# Altium project Smartplug.PrjPCB
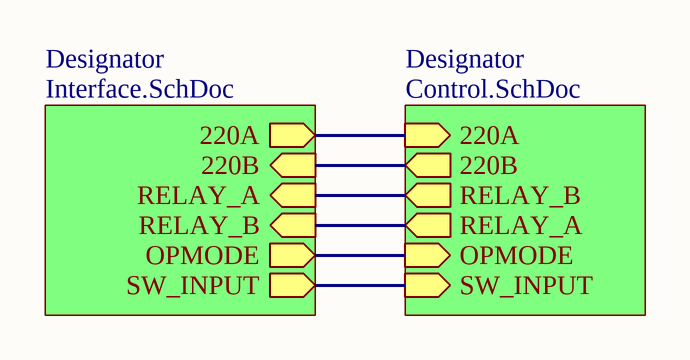
[diagram p0: Smartplug.SchDoc]
3 sheets, 28 parts. Net scope: hierarchical (ports join the sheet entries above them; power ports are global).
Board file: Smartplug.PcbDoc
Sheets:
  Smartplug.SchDoc
    Designator = Control.SchDoc
    Designator = Interface.SchDoc

## Sheet Smartplug.SchDoc
size A

### Sub-sheets
Designator = Control.SchDoc: SW_INPUT (in), 220A (in), 220B (out), OPMODE (in), RELAY_A (out), RELAY_B (out)
Designator = Interface.SchDoc: SW_INPUT (out), 220B (in), 220A (out), RELAY_A (in), RELAY_B (in), OPMODE (out)

### Nets
K1_IN: sheet Designator/220B, sheet Designator/220B
SWIN: sheet Designator/SW_INPUT, sheet Designator/SW_INPUT
NetJ2_1: sheet Designator/220A, sheet Designator/220A
NetJ4_1: sheet Designator/OPMODE, sheet Designator/OPMODE
NetK1_5: sheet Designator/RELAY_B, sheet Designator/RELAY_A
NetK2_5: sheet Designator/RELAY_A, sheet Designator/RELAY_B

## Sheet Control.SchDoc
size A
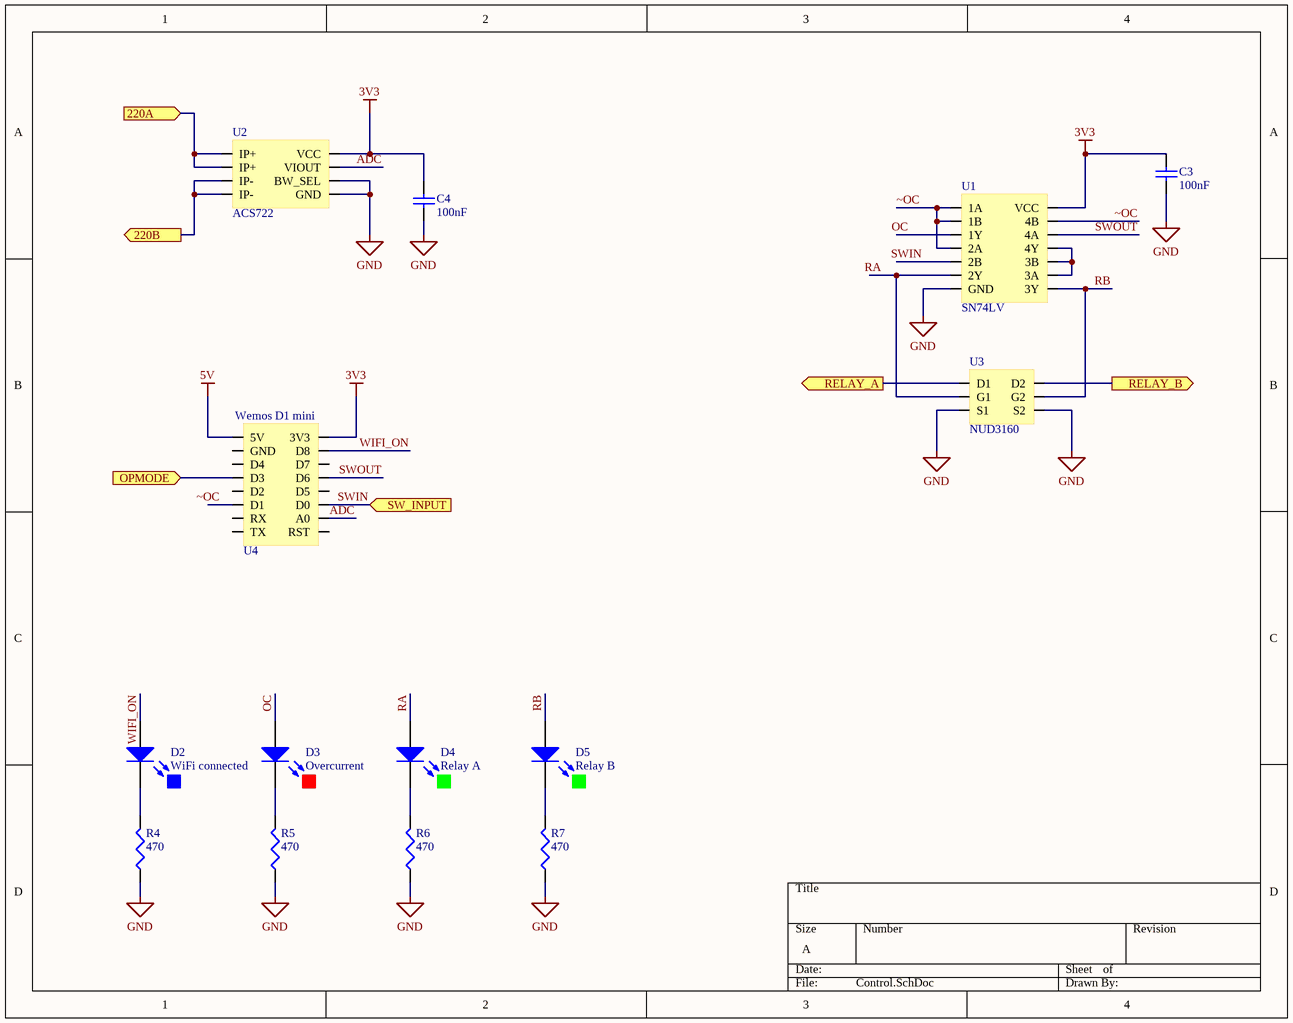
[diagram p1: Control.SchDoc]

### Parts
C3  value 100nF  [C0805]  (hidden comment: Cap)
C4  value 100nF  [C0805]  (hidden comment: Cap)
D2  WiFi connected  [3.2X1.6X1.1]
D3  Overcurrent  [3.2X1.6X1.1]
D4  Relay A  [3.2X1.6X1.1]
D5  Relay B  [3.2X1.6X1.1]
R4  value 470  [J1-0603]  (hidden comment: Res3)
R5  value 470  [J1-0603]  (hidden comment: Res3)
R6  value 470  [J1-0603]  (hidden comment: Res3)
R7  value 470  [J1-0603]  (hidden comment: Res3)
U1  SN74LV  [TSSOP14]
U2  ACS722  [SOIC8]
U3  NUD3160  [SC-74]
U4  Wemos D1 mini  [WEMOS_D1]

### Ports
220A (in), 220B (out), OPMODE (in), RELAY_A (out), RELAY_B (out), SW_INPUT (in)

### Nets
3V3: C3.2 C4.2 U1.14(VCC) U2.8(VCC) U4.16(3V3)
5V: U4.1(5V)
GND: C3.1 C4.1 R4.1 R5.1 R6.1 R7.1 U1.7(GND) U2.5(GND) U2.6(BW_SEL) U3.1(S1) U3.4(S2)
ADC: U2.7(VIOUT) U4.10(A0)
K1_IN: U2.3(IP-) U2.4(IP-) ; port 220B
OC: D3.1(A) U1.3(1Y)
RA: D4.1(A) U1.6(2Y) U3.2(G1)
RB: D5.1(A) U1.8(3Y) U3.5(G2)
SWIN: U1.5(2B) U4.11(D0) ; port SW_INPUT
SWOUT: U1.12(4A) U4.13(D6)
WIFI_ON: D2.1(A) U4.15(D8)
~OC: U1.1(1A) U1.2(1B) U1.4(2A) U1.13(4B) U4.6(D1)
NetD2_2: D2.2(K) R4.2
NetD3_2: D3.2(K) R5.2
NetD4_2: D4.2(K) R6.2
NetD5_2: D5.2(K) R7.2
NetJ2_1: U2.1(IP+) U2.2(IP+) ; port 220A
NetJ4_1: U4.4(D3) ; port OPMODE
NetK1_5: U3.3(D2) ; port RELAY_B
NetK2_5: U3.6(D1) ; port RELAY_A
NetU1_9: U1.9(3A) U1.10(3B) U1.11(4Y)

Not connected (* = marked no-connect by the designer): U4 2(GND) 3(D4) 5(D2) 7(RX) 8(TX) 9(RST) 12(D5) 14(D7)

### Library data of the parts
C3 C4 = Cap: Capacitor; Manufacturer 1: KEMET; Manufacturer Part Number 1: C0805C104Z5VACTU; Description 1: KEMET         C0805C104Z5VACTU.             CERAMIC CAPACITOR, 0.1UF, 50V, Y5V, +80,-20%, 0805; Dielectric Material: Ceramic; Voltage Rating: 50V; Tolerance: 80%; Dielectric: Y5V; Dissipation Factor: 5%; Published: 8-Jun-2000; LatestRevisionDate: 17-Jul-2002; LatestRevisionNote: Re-released for DXP Platform.; PackageReference: RAD-0.3; Publisher: Altium Limited; PackageDescription: Radial Cap, Thru-Hole; 2 Leads; 0.3 in Pin Spacing; Supplier 1: Digi-Key; Supplier Part Number 1: 399-1177-6-ND; Stock: 978536; Pricing 1: 1=0.1, 10=0.057, 100=0.0254, 500=0.01818, 1000=0.01428 (USD); Mount: Surface Mount,PCB; Case/Package: 0805; Number of Pins: 2; Case Code (Metric): 2012; Case Code (Imperial): 0805; Min Operating Temperature: -30°C; Max Operating Temperature: 85°C; Package Quantity: 1; Capacitance: 100nF; Packaging: Tape and Reel; Voltage Rating (DC): 50V; Termination: SMD/SMT; Voltage: 50V; Length: 2mm; Height: 0.9mm; Lead Pitch: 0.75mm; Width: 0.049inch; Thickness: 0.039inch; Depth: 1.25mm; Radiation Hardening: No; REACH SVHC: No SVHC; Lead Free: Lead Free; ComponentLink1URL: http://www.alliedelec.com/m/d/9bfe7773041ffe9d406e68bc7b377fdd.pdf?src-supplier=Allied+Electronics; ComponentLink1Description: http://www.alliedelec.com/m/d/9bfe7773041ffe9d406e68bc7b377fdd.pdf?src-supplier=Allied+Electronics; ComponentLink2URL: https://www.verical.com/server-webapp/html/getDatasheet?partID=37101&src-supplier=Verical; ComponentLink2Description: https://www.verical.com/server-webapp/html/getDatasheet?partID=37101&src-supplier=Verical; ComponentLink3URL: https://www.verical.com/server-webapp/html/getDatasheet?partID=321176&src-supplier=Verical; ComponentLink3Description: https://www.verical.com/server-webapp/html/getDatasheet?partID=321176&src-supplier=Verical; ComponentLink4URL: http://www.farnell.com/datasheets/2123124.pdf?src-supplier=Element14; ComponentLink4Description: http://www.farnell.com/datasheets/2123124.pdf?src-supplier=Element14
D2-D5 = LED2: Typical RED, GREEN, YELLOW, AMBER GaAs LED; Manufacturer 1: Stanley; Manufacturer Part Number 1: BR1101W-TR; Description 1: Red 1206 152/141° 12.8 mcd Clear 1.7 V LED Surface Mount; Lens Style: Clear; Forward Voltage: 1.7V; Viewing Angle: 141°; Wavelength: 660nm; Luminous Intensity: 12.8mcd; Published: 8-Jun-2000; LatestRevisionDate: 17-Jul-2002; LatestRevisionNote: Re-released for DXP Platform.; PackageVersion: Feb-2002; PackageReference: 3.2X1.6X1.1; Publisher: Altium Limited; PackageDescription: SM LED; 2 Flat Leads; Supplier 1: Digi-Key; Supplier Part Number 1: 404-1042-6-ND; Stock: 56287; Pricing 1: 1=0.47, 10=0.334, 100=0.195, 500=0.13368, 1000=0.1114 (USD); Mount: Surface Mount; Case/Package: 1206; Color: Red; Packaging: Cut Tape; Length: 3mm; Height: 1.5mm; Width: 1.5mm; Lead Free: Lead Free; ComponentLink1URL: http://www1.futureelectronics.com/doc/STANLEY/BR1101W-TR.pdf?src-supplier=Future+Electronics; ComponentLink1Description: http://www1.futureelectronics.com/doc/STANLEY/BR1101W-TR.pdf?src-supplier=Future+Electronics
R4-R7 = Res3: Resistor; Manufacturer 1: TE Connectivity; Manufacturer Part Number 1: CRGCQ0603J470R; Description 1: TE CONNECTIVITY - CRGCQ0603J470R - RES, 470R, 5%, 0603, THICK FILM; Resistance: 470R; Tolerance: 5%; Max Power Dissipation: 100mW; Temperature Coefficient: 100ppm/°C; Published: 8-Jun-2000; LatestRevisionDate: 29-May-2009; LatestRevisionNote: IPC-7351 Footprint Added.; PackageReference: J1-0603; Publisher: Altium Limited; PackageDescription: Chip Resistor; Supplier 1: Digi-Key; Supplier Part Number 1: A130089DKR-ND; Stock: 87954; Pricing 1: 1=0.1, 10=0.021, 100=0.0086, 1000=0.00387, 2500=0.00336 (USD); Case/Package: 0603; Case Code (Imperial): 0603; Case Code (Metric): 1608; Min Operating Temperature: -55°C; Max Operating Temperature: 155°C; Composition: Thick Film; Features: Moisture Resistant,Automotive AEC-Q200; Packaging: Tape and Reel; Number of Terminations: 2; ComponentLink1URL: https://4donline.ihs.com/images/VipMasterIC/IC/TYEL/TYEL-S-A0004929575/TYEL-S-A0004929575-1.pdf?hkey=52A5661711E402568146F3353EA87419&src-supplier=Farnell; ComponentLink1Description: https://4donline.ihs.com/images/VipMasterIC/IC/TYEL/TYEL-S-A0004929575/TYEL-S-A0004929575-1.pdf?hkey=52A5661711E402568146F3353EA87419&src-supplier=Farnell; ComponentLink2URL: https://4donline.ihs.com/images/VipMasterIC/IC/TYEL/TYEL-S-A0004929575/TYEL-S-A0004929575-1.pdf?hkey=52A5661711E402568146F3353EA87419&src-supplier=Newark; ComponentLink2Description: https://4donline.ihs.com/images/VipMasterIC/IC/TYEL/TYEL-S-A0004929575/TYEL-S-A0004929575-1.pdf?hkey=52A5661711E402568146F3353EA87419&src-supplier=Newark; ComponentLink3URL: https://www.te.com/commerce/DocumentDelivery/DDEController?Action=srchrtrv&amp;DocNm=1773204-3&amp;DocType=DS&amp;DocLang=English&src-supplier=Digi-Key; ComponentLink3Description: https://www.te.com/commerce/DocumentDelivery/DDEController?Action=srchrtrv&amp;DocNm=1773204-3&amp;DocType=DS&amp;DocLang=English&src-supplier=Digi-Key; ComponentLink4URL: https://www.te.com/commerce/DocumentDelivery/DDEController?Action=srchrtrv&DocNm=1773204-3&DocType=DS&DocLang=English&src-supplier=Digi-Key; ComponentLink4Description: https://www.te.com/commerce/DocumentDelivery/DDEController?Action=srchrtrv&DocNm=1773204-3&DocType=DS&DocLang=English&src-supplier=Digi-Key
U1 = SN74LVC00APWR: IC GATE NAND 4CH 2-INP 14-SSOP; Manufacturer 1: Texas Instruments; Description 1: IC GATE NAND 4CH 2-INP 14TSSOP; Propagation Delay: 4.1ns; Min Supply Voltage: 1.65V; Max Supply Voltage: 3.6V; Number of Elements: 4; Turn-On Delay Time: 4.3ns; Number of Inputs: 2; Number of Outputs: 1; Output Current: 24mA; Quiescent Current: 1uA; High Level Output Current: -24mA; Schmitt Trigger Input: No; Supplier 1: Digi-Key; Supplier Part Number 1: 296-1216-6-ND; Manufacturer Part Number 1: SN74LVC00APWR; Stock: 19024; Pricing 1: 1=0.41, 10=0.308, 100=0.1918, 500=0.13122, 1000=0.10094 (USD); Mount: Surface Mount; Case/Package: TSSOP; Number of Pins: 14; Weight: 0.002018oz; Contact Plating: Gold; Min Operating Temperature: -40°C; Max Operating Temperature: 125°C; Package Quantity: 1; Packaging: Tape and Reel; Logic Function: NAND; Number of Bits: 4; Number of Gates: 4; Number of Circuits: 4; Low Level Output Current: 24mA; Number of Input Lines: 2; Number of Output Lines: 1; Max Output Current: 24mA; Termination: SMD/SMT; Length: 5mm; Height: 1.15mm; Width: 4.4mm; Radiation Hardening: No; Lead Free: Lead Free; REACH SVHC: No SVHC; ComponentLink1URL: http://www.ti.com/lit/ds/symlink/sn74lvc00a.pdf?src-supplier=Digi-Key; ComponentLink1Description: http://www.ti.com/lit/ds/symlink/sn74lvc00a.pdf?src-supplier=Digi-Key; ComponentLink2URL: http://www.ti.com/general/docs/lit/getliterature.tsp?genericPartNumber=SN54LVC00A&&fileType=pdf&src-supplier=Avnet; ComponentLink2Description: http://www.ti.com/general/docs/lit/getliterature.tsp?genericPartNumber=SN54LVC00A&&fileType=pdf&src-supplier=Avnet; ComponentLink3URL: http://www.ti.com/general/docs/lit/getliterature.tsp?genericPartNumber=SN74LVC00A&amp;&amp;fileType=pdf&src-supplier=Newark; ComponentLink3Description: http://www.ti.com/general/docs/lit/getliterature.tsp?genericPartNumber=SN74LVC00A&amp;&amp;fileType=pdf&src-supplier=Newark; ComponentLink4URL: http://www.farnell.com/datasheets/1764343.pdf?src-supplier=Element14; ComponentLink4Description: http://www.farnell.com/datasheets/1764343.pdf?src-supplier=Element14; ComponentLink5URL: http://www.farnell.com/datasheets/2018849.pdf?src-supplier=Element14; ComponentLink5Description: http://www.farnell.com/datasheets/2018849.pdf?src-supplier=Element14; ComponentLink6URL: http://www.produktinfo.conrad.com/datenblaetter/1000000-1099999/001017089-da-01-en-IC_QUA_2IN_PO_SN74LVC00APWR_TSSOP_14_TID.pdf?src-supplier=Conrad; ComponentLink6Description: http://www.produktinfo.conrad.com/datenblaetter/1000000-1099999/001017089-da-01-en-IC_QUA_2IN_PO_SN74LVC00APWR_TSSOP_14_TID.pdf?src-supplier=Conrad
U2 = ACS722LLCTR-20AB-T: SENSOR CURRENT HALL 20A AC/DC; Manufacturer 1: Allegro MicroSystems; Number of Channels: 1; Frequency: 80kHz; Response Time: 5us; Max Supply Current: 12mA; Polarity: Bidirectional; Max Input Voltage: 3.6V; Min Input Voltage: 3V; Linearity: 1%; Accuracy: 3%; Quiescent Current: 9mA; Sensitivity: 66mV/A; Supplier 1: Digi-Key; Supplier Part Number 1: 620-1637-6-ND; Manufacturer Part Number 1: ACS722LLCTR-20AB-T; Description 1: SENSOR CURRENT HALL 20A AC/DC; Stock: 4729; Pricing 1: 1=4.91, 5=4.332, 10=3.827, 25=3.1052, 50=2.7442, 100=2.672, 500=2.23866, 1000=2.09424 (USD); Case/Package: SOIC; Number of Pins: 8; Packaging: Tape and Reel; Bandwidth: 80kHz; Current Sensing: 20A; Length: 4.9mm; Height: 1.5mm; Width: 3.9mm; ComponentLink1URL: https://www.allegromicro.com/~/media/Files/Datasheets/ACS722-Datasheet.ashx?src-supplier=Digi-Key; ComponentLink1Description: https://www.allegromicro.com/~/media/Files/Datasheets/ACS722-Datasheet.ashx?src-supplier=Digi-Key; ComponentLink2URL: http://www.allegromicro.com/~/media/Files/Datasheets/ACS722-Datasheet.ashx?src-supplier=Digi-Key; ComponentLink2Description: http://www.allegromicro.com/~/media/Files/Datasheets/ACS722-Datasheet.ashx?src-supplier=Digi-Key
U3 = NUD3160DMT1G: IC INDCT LOAD DRVR INDUST SC74-6; Manufacturer 1: ON Semiconductor; Number of Outputs: 2; Max Supply Voltage: 60V; Rise Time: 600ns; Interface: On/Off; Max Output Current: 150mA; Gate to Source Voltage (Vgs): 12V; Power Dissipation: 380mW; Output Configuration: Low Side; Output Current: 200mA; Output Voltage: 61V; Current Rating: 263mA; Drain to Source Resistance: 1.8R; Element Configuration: Dual; On-State Resistance: 3.7R; Supplier 1: Digi-Key; Supplier Part Number 1: NUD3160DMT1GOSDKR-ND; Manufacturer Part Number 1: NUD3160DMT1G; Description 1: IC INDCT LOAD DRVR INDUST SC74-6; Stock: 11786; Pricing 1: 1=0.45, 10=0.367, 100=0.2264, 500=0.17176, 1000=0.12882 (USD); Mount: Surface Mount; Case/Package: SC; Number of Pins: 6; Contact Plating: Tin,Matte; Min Operating Temperature: -40°C; Max Operating Temperature: 125°C; Packaging: Tape and Reel; Package Quantity: 3000; Continuous Drain Current (ID): 150mA; Fall Time: 600ns; Number of Elements: 2; Drain to Source Breakdown Voltage: 60V; Drain to Source Voltage (Vdss): 60V; Length: 3mm; Height: 0.94mm; Width: 1.5mm; Radiation Hardening: No; Lead Free: Lead Free; Halogen Free: Halogen Free; REACH SVHC: No SVHC; ComponentLink1URL: http://www.onsemi.com/pub_link/Collateral/NUD3160-D.PDF?src-supplier=Digi-Key; ComponentLink1Description: http://www.onsemi.com/pub_link/Collateral/NUD3160-D.PDF?src-supplier=Digi-Key; ComponentLink2URL: http://www.onsemi.ru.com/pub/Collateral/NUD3160-D.PDF?src-supplier=Avnet+Europe; ComponentLink2Description: http://www.onsemi.ru.com/pub/Collateral/NUD3160-D.PDF?src-supplier=Avnet+Europe; ComponentLink3URL: http://www.onsemi.com/pub/Collateral/NUD3160-D.PDF?src-supplier=Digi-Key; ComponentLink3Description: http://www.onsemi.com/pub/Collateral/NUD3160-D.PDF?src-supplier=Digi-Key; ComponentLink4URL: http://www.onsemi.cn/pub_link/Collateral/NUD3160-D.PDF?src-supplier=Avnet; ComponentLink4Description: http://www.onsemi.cn/pub_link/Collateral/NUD3160-D.PDF?src-supplier=Avnet; ComponentLink5URL: http://www.onsemi.ru.com/pub/Collateral/NUD3160-D.PDF?src-supplier=Avnet; ComponentLink5Description: http://www.onsemi.ru.com/pub/Collateral/NUD3160-D.PDF?src-supplier=Avnet
U4 = ESP8266: ESP8266 based MCU with Wi-Fi; Manufacturer Part Number 1: D1 mini; Manufacturer 1: Wemos; ComponentLink1Description: Datasheet; ComponentLink1URL: https://docs.wemos.cc/en/latest/d1/d1_mini.html

## Sheet Interface.SchDoc
size A
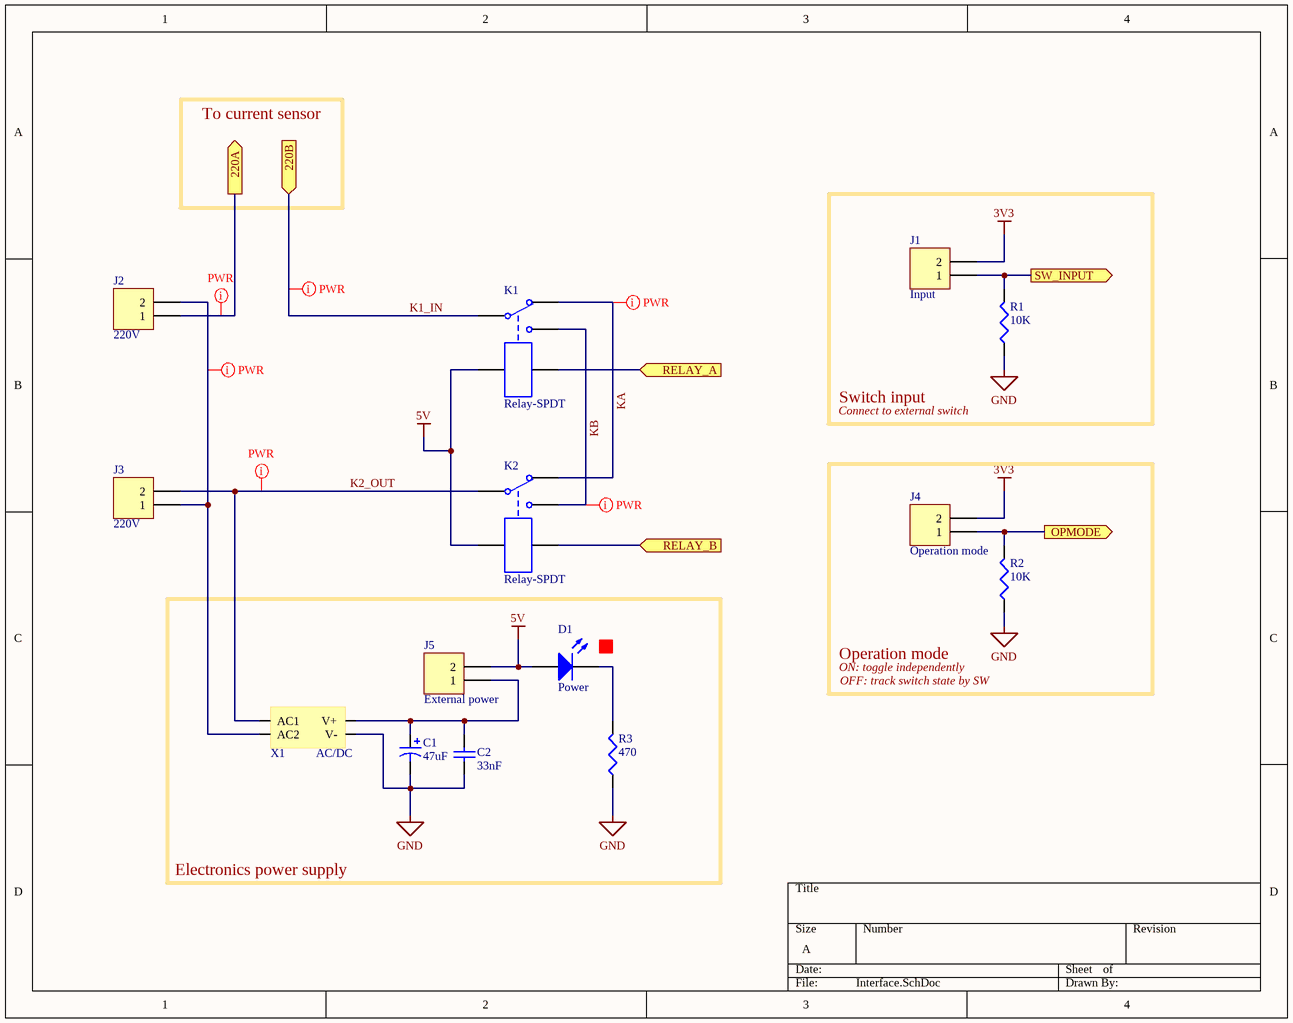
[diagram p2: Interface.SchDoc]

### Parts
C1  value 47uF  [CAP47U]  (hidden comment: Cap Pol1)
C2  value 33nF  [C0805]  (hidden comment: Cap)
D1  Power  [3.2X1.6X1.1]
J1  Input  [TBLOCK2]
J2  220V  [TBLOCK2]
J3  220V  [TBLOCK2]
J4  Operation mode  [HEADER2]
J5  External power  [HEADER2]
K1  Relay-SPDT  [G5LE-1C]
K2  Relay-SPDT  [G5LE-1C]
R1  value 10K  [J1-0603]  (hidden comment: Res3)
R2  value 10K  [J1-0603]  (hidden comment: Res3)
R3  value 470  [J1-0603]  (hidden comment: Res3)
X1  AC/DC  [HLK-PM01]

### Blocks framed on the sheet
Switch input: J1 R1
Operation mode: J4 R2
Electronics power supply: C1 C2 D1 J5 R3 X1

### Ports
220A (out), 220B (in), OPMODE (out), RELAY_A (in), RELAY_B (in), SW_INPUT (out)

### Nets
3V3: J1.2 J4.2
5V: D1.1(A) J5.2 K1.4 K2.4
GND: C1.2 C2.1 R1.1 R2.1 R3.1 X1.3(V-)
K1_IN: K1.1 ; port 220B
K2_OUT: J3.2 K2.1 X1.1(AC1)
KA: K1.2 K2.2
KB: K1.3 K2.3
SWIN: J1.1 R1.2 ; port SW_INPUT
NetC1_1: C1.1 C2.2 J5.1 X1.4(V+)
NetD1_2: D1.2(K) R3.2
NetJ2_1: J2.1 ; port 220A
NetJ2_2: J2.2 J3.1 X1.2(AC2)
NetJ4_1: J4.1 R2.2 ; port OPMODE
NetK1_5: K1.5 ; port RELAY_A
NetK2_5: K2.5 ; port RELAY_B

### Layout directives
net class power: K1_IN, K2_OUT, KA, KB, NetJ2_1, NetJ2_2

### Notes on the sheet
- To current sensor
- Connect to external switch
- ON: toggle independently
- OFF: track switch state by SW

### Library data of the parts
C1 = Cap Pol1: Polarized Capacitor (Radial); Manufacturer 1: Nichicon; Manufacturer Part Number 1: UWT1E470MCL6GS; Description 1: Aluminum Electrolytic Capacitors - SMD 25volts 47uF 6.3x5.8 20%; Dielectric Material: Aluminium; Voltage Rating: 25V; Tolerance: 20%; Ripple Current: 59mA; Leakage Current: 3uA; Life (Hours): 1000Hour; Dissipation Factor: 0.16%; Published: 8-Jun-2000; LatestRevisionDate: 17-Jul-2002; LatestRevisionNote: Re-released for DXP Platform.; PackageReference: RB7.6-15; Publisher: Altium Limited; PackageDescription: Polarized Capacitor (Radial); 2 Leads; Supplier 1: Digi-Key; Supplier Part Number 1: 493-9881-6-ND; Stock: 12722; Pricing 1: 1=0.29, 10=0.202, 100=0.1143, 500=0.08072 (USD); Mount: Surface Mount; Case/Package: Radial; Min Operating Temperature: -55°C; Max Operating Temperature: 105°C; Capacitance: 47uF; Package Quantity: 1000; Voltage Rating (DC): 25V; Packaging: Tape and Reel; Termination: SMD/SMT; Features: General Purpose; Diameter: 6.3mm; Length: 5.8mm; Height: 6.6mm; Radiation Hardening: No; Lead Free: Lead Free; ComponentLink1URL: http://www.mouser.com/ds/2/293/e-wt-30307.pdf?src-supplier=Mouser; ComponentLink1Description: http://www.mouser.com/ds/2/293/e-wt-30307.pdf?src-supplier=Mouser; ComponentLink2URL: https://www.verical.com/server-webapp/html/getDatasheet?partID=732041&src-supplier=Verical; ComponentLink2Description: https://www.verical.com/server-webapp/html/getDatasheet?partID=732041&src-supplier=Verical; ComponentLink3URL: http://www.nichicon.co.jp/english/products/pdfs/e-ch_ref.pdf?src-supplier=Digi-Key; ComponentLink3Description: http://www.nichicon.co.jp/english/products/pdfs/e-ch_ref.pdf?src-supplier=Digi-Key; ComponentLink4URL: http://nichicon-us.com/english/products/pdfs/e-wt.pdf?src-supplier=Future+Electronics; ComponentLink4Description: http://nichicon-us.com/english/products/pdfs/e-wt.pdf?src-supplier=Future+Electronics; ComponentLink5URL: http://www.nichicon.co.jp/english/products/pdfs/e-wt.pdf?src-supplier=Avnet+Europe; ComponentLink5Description: http://www.nichicon.co.jp/english/products/pdfs/e-wt.pdf?src-supplier=Avnet+Europe
C2 = Cap: Capacitor; Manufacturer 1: KEMET; Manufacturer Part Number 1: C0805C333K5RACTU; Description 1: KEMET - C0805C333K5RACTU - SMD Multilayer Ceramic Capacitor, 33000 pF, 50 V, 0805 [2012 Metric], ± 10%, X7R, C Series KEMET; Dielectric Material: Ceramic; Tolerance: 10%; Dielectric: X7R; Voltage Rating (DC): 50V; Published: 8-Jun-2000; LatestRevisionDate: 17-Jul-2002; LatestRevisionNote: Re-released for DXP Platform.; PackageReference: RAD-0.3; Publisher: Altium Limited; PackageDescription: Radial Cap, Thru-Hole; 2 Leads; 0.3 in Pin Spacing; Supplier 1: Digi-Key; Supplier Part Number 1: 399-1165-6-ND; Stock: 116403; Pricing 1: 1=0.12, 10=0.087, 100=0.0407, 500=0.02856, 1000=0.02364 (USD); Mount: Surface Mount; Case/Package: 0805; Min Operating Temperature: -55°C; Max Operating Temperature: 125°C; Capacitance: 33nF; Packaging: Tape and Reel; Voltage: 50V; Termination: SMD/SMT; Length: 2mm; Height: 0.78mm; Depth: 1.25mm; Radiation Hardening: No; ComponentLink1URL: http://www.kemet.com/kemet/web/homepage/kechome.nsf/vapubfiles/KEM_C1002_X7R_SMD.pdf/$file/KEM_C1002_X7R_SMD.pdf?src-supplier=Element14; ComponentLink1Description: http://www.kemet.com/kemet/web/homepage/kechome.nsf/vapubfiles/KEM_C1002_X7R_SMD.pdf/$file/KEM_C1002_X7R_SMD.pdf?src-supplier=Element14; ComponentLink2URL: http://www.onlinecomponents.com/productFiles/mf-KEM/kem_c1002_x7r_smd.pdf?src-supplier=Onlinecomponents.com; ComponentLink2Description: http://www.onlinecomponents.com/productFiles/mf-KEM/kem_c1002_x7r_smd.pdf?src-supplier=Onlinecomponents.com
D1 = LED2: Typical RED, GREEN, YELLOW, AMBER GaAs LED; Manufacturer 1: Stanley; Manufacturer Part Number 1: PG1101W-TR; Description 1: LED GREEN CLEAR 3216 SMD; Lens Style: Clear; Forward Voltage: 2.1V; Viewing Angle: 137°; Wavelength: 560nm; Luminous Intensity: 4.8mcd; Published: 8-Jun-2000; LatestRevisionDate: 17-Jul-2002; LatestRevisionNote: Re-released for DXP Platform.; PackageVersion: Feb-2002; PackageReference: 3.2X1.6X1.1; Publisher: Altium Limited; PackageDescription: SM LED; 2 Flat Leads; Supplier 1: Digi-Key; Supplier Part Number 1: 404-1046-6-ND; Stock: 64799; Pricing 1: 1=0.45, 10=0.316, 100=0.1841, 500=0.12624, 1000=0.1052 (USD); Mount: Surface Mount; Case/Package: 1206; Color: Green; Packaging: Cut Tape; Length: 3mm; Height: 1.5mm; Width: 1.5mm; Lead Free: Lead Free; ComponentLink1URL: http://www1.futureelectronics.com/doc/STANLEY/PG1101W-TR.pdf?src-supplier=Future+Electronics; ComponentLink1Description: http://www1.futureelectronics.com/doc/STANLEY/PG1101W-TR.pdf?src-supplier=Future+Electronics
J1-J3 = Header 2: Header, 2-Pin; Manufacturer 1: TE Connectivity; Manufacturer Part Number 1: 282834-2; Description 1: TE CONNECTIVITY / BUCHANAN - 282834-2 - TERMINAL BLOCK, WIRE TO BRD, 2POS, 16AWG; Plating: Brass,Steel; Max Voltage Rating (AC): 150V; Number of Poles: 2; Gender: Male; Current Rating: 10A; Number of Levels: 1; Connector Type: Receptacle; Closed End: No (Without); Screwless Terminal Block: Yes (With); Wire Gauge (Max): 30AWG; Pitch: 2.54mm; Thread Size: M1.6; Tail Length: 3.4mm; Approvals: UL; LatestRevisionDate: 17-Jul-2002; LatestRevisionNote: Re-released for DXP Platform.; Publisher: Altium Limited; Supplier 1: Digi-Key; Supplier Part Number 1: A98333-ND; Stock: 18918; Pricing 1: 1=0.92, 10=0.649, 25=0.6048, 50=0.549, 100=0.5467, 250=0.46164, 500=0.43732, 1000=0.38874, 5000=0.36444 (USD); Mount: Through Hole; Contact Plating: Tin; Contact Material: Brass; Color: Green; Material: Nylon; Housing Color: Green; Housing Material: Polyamide; Min Operating Temperature: -40°C; Max Operating Temperature: 105°C; Number of Rows: 1; Voltage Rating: 150V; Package Quantity: 300; Packaging: Bulk; Number of Positions: 2; Termination: Solder; Number of Positions Per Level: 2; Current: 10A; Voltage: 150V; Max Supply Voltage (AC): 150V; Number of Contacts: 2; Number of Circuits: 2; Orientation: Straight; Max Current Rating: 10A; Interlock: No (Without); Screw Flange: No (Without); Side Stackable: Yes (With); Length: 5.54mm; Wire Gauge (Min): 30AWG; Width: 6.5mm; Wire/Cable Gauge: 30AWG; Depth: 6.5mm; Radiation Hardening: No; REACH SVHC: Unknown; ELV: Compliant; Lead Free: Lead Free; Flammability Rating: UL94 V-0; ComponentLink1URL: https://www.alliedelec.com/m/d/020b790adaa0bc8636bbfa0190e2b719.pdf?src-supplier=Allied+Electronics; ComponentLink1Description: https://www.alliedelec.com/m/d/020b790adaa0bc8636bbfa0190e2b719.pdf?src-supplier=Allied+Electronics; ComponentLink2URL: https://www.verical.com/server-webapp/html/getDatasheet?partID=155864&src-supplier=Verical; ComponentLink2Description: https://www.verical.com/server-webapp/html/getDatasheet?partID=155864&src-supplier=Verical; ComponentLink3URL: http://www.te.com/commerce/DocumentDelivery/DDEController?Action=showdoc&DocId=Catalog+Section%7F1308389_EUROSTYLE_TERMINAL_BLOCKS%7F0607%7Fpdf%7FEnglish%7FENG_CS_1308389_EUROSTYLE_TERMINAL_BLOCKS_0607.pdf&src-supplier=Avnet; ComponentLink3Description: http://www.te.com/commerce/DocumentDelivery/DDEController?Action=showdoc&DocId=Catalog+Section%7F1308389_EUROSTYLE_TERMINAL_BLOCKS%7F0607%7Fpdf%7FEnglish%7FENG_CS_1308389_EUROSTYLE_TERMINAL_BLOCKS_0607.pdf&src-supplier=Avnet; ComponentLink4URL: http://www1.futureelectronics.com/doc/TE%20CONNECTIVITY/282834-2.pdf?src-supplier=Future+Electronics; ComponentLink4Description: http://www1.futureelectronics.com/doc/TE%20CONNECTIVITY/282834-2.pdf?src-supplier=Future+Electronics; ComponentLink5URL: https://www.te.com/commerce/DocumentDelivery/DDEController?Action=srchrtrv&DocNm=1308389_EUROSTYLE_TERMINAL_BLOCKS&DocType=CS&DocLang=English&src-supplier=Digi-Key; ComponentLink5Description: https://www.te.com/commerce/DocumentDelivery/DDEController?Action=srchrtrv&DocNm=1308389_EUROSTYLE_TERMINAL_BLOCKS&DocType=CS&DocLang=English&src-supplier=Digi-Key; ComponentLink6URL: http://www.te.com/commerce/DocumentDelivery/DDEController?Action=showdoc&DocId=Catalog+Section%7F1308389_EUROSTYLE_TERMINAL_BLOCKS%7F0607%7Fpdf%7FEnglish%7FENG_CS_1308389_EUROSTYLE_TERMINAL_BLOCKS_0607.pdf&src-supplier=Avnet+Europe; ComponentLink6Description: http://www.te.com/commerce/DocumentDelivery/DDEController?Action=showdoc&DocId=Catalog+Section%7F1308389_EUROSTYLE_TERMINAL_BLOCKS%7F0607%7Fpdf%7FEnglish%7FENG_CS_1308389_EUROSTYLE_TERMINAL_BLOCKS_0607.pdf&src-supplier=Avnet+Europe; ComponentLink7URL: http://www.onlinecomponents.com/productFiles/mf-AMP/eng_cs_1308389_eurostyle_terminal_blocks_0607.pdf?src-supplier=Onlinecomponents.com; ComponentLink7Description: http://www.onlinecomponents.com/productFiles/mf-AMP/eng_cs_1308389_eurostyle_terminal_blocks_0607.pdf?src-supplier=Onlinecomponents.com
J4 J5 = Header 2: Header, 2-Pin; Manufacturer 1: Amphenol FCI; Manufacturer Part Number 1: 77311-118-02LF; Description 1: Conn;  Rect;  UnshroudedHdr;  2Cnts;  ThruHole;  BergStik;  2.54mmPin-Spng;  Vert;  SingleRow; Current Rating: 3A; Voltage Rating: 1.5kV; Number of Positions: 2; Insulation Resistance: 5GR; Gender: Male; Connector Type: Male Pin; Pitch: 2.54mm; Contact Post Length: 3.05mm; LatestRevisionDate: 17-Jul-2002; LatestRevisionNote: Re-released for DXP Platform.; Publisher: Altium Limited; Supplier 1: Digi-Key; Supplier Part Number 1: 609-4434-ND; Stock: 85355; Pricing 1: 1=0.19, 10=0.182, 100=0.1258, 500=0.10648, 1000=0.08712, 5000=0.07744, 10000=0.07018 (USD); Mount: Through Hole; Contact Plating: Gold,GXT; Contact Material: Bronze; Color: Black; Housing Color: Black; Material: Thermoplastic; Housing Material: Thermoplastic; Min Operating Temperature: -65°C; Max Operating Temperature: 125°C; Number of Rows: 1; Contact Gender: Male; Package Quantity: 1000; Packaging: Bulk; Termination: Solder; Number of Contacts: 2; Max Voltage Rating (AC): 1.5kV; Orientation: Straight; Length: 5.08mm; Contact Mating Length: 0.23inch; Depth: 2.4mm; Radiation Hardening: No; REACH SVHC: No SVHC; Lead Free: Lead Free; Flammability Rating: UL94 V-0; ComponentLink1URL: https://cdn.amphenol-icc.com/media/wysiwyg/files/drawing/77311.pdf?src-supplier=Digi-Key; ComponentLink1Description: https://cdn.amphenol-icc.com/media/wysiwyg/files/drawing/77311.pdf?src-supplier=Digi-Key; ComponentLink2URL: http://portal.fciconnect.com/Comergent/fci/drawing/77311.pdf?src-supplier=Avnet+Asia; ComponentLink2Description: http://portal.fciconnect.com/Comergent/fci/drawing/77311.pdf?src-supplier=Avnet+Asia; ComponentLink3URL: http://portal.fciconnect.com/Comergent/fci/drawing/77311.pdf?src-supplier=Avnet; ComponentLink3Description: http://portal.fciconnect.com/Comergent/fci/drawing/77311.pdf?src-supplier=Avnet; ComponentLink4URL: https://www.alliedelec.com/m/d/695616ca3fa695a35268331f95f01020.pdf?src-supplier=Allied+Electronics; ComponentLink4Description: https://www.alliedelec.com/m/d/695616ca3fa695a35268331f95f01020.pdf?src-supplier=Allied+Electronics
K1 K2 = Relay-SPDT: Single-Pole Dual-Throw Relay; Manufacturer 1: Omron; Manufacturer Part Number 1: G5LE-14-DC3; Description 1: RELAY GEN PURPOSE SPDT 10A 3V; Throw Configuration: SPDT; Coil Resistance: 22.5R; Coil Current: 133mA; Operate Time: 10ms; Release Time: 5ms; Coil Power: 400mW; Max Voltage Rating (AC): 250V; Max Voltage Rating (DC): 125V; Relay Type: General Purpose; Coil Type: Non-Latching; Coil Voltage (DC): 3V; Contact Current Rating: 10A; Published: 24-Mar-1999; LatestRevisionDate: 17-Jul-2002; LatestRevisionNote: Re-released for DXP Platform.; PackageReference: MODULE5B; Publisher: Altium Limited; Supplier 1: Digi-Key; Supplier Part Number 1: Z3326-ND; Stock: 12824; Pricing 1: 1=1.44, 10=1.35, 25=1.2004, 50=1.1404, 100=1.0804, 250=0.96032, 500=0.9003, 1000=0.84028, 5000=0.81027 (USD); Mount: Through Hole; Number of Pins: 5; Weight: 12g; Contact Material: Tin,Silver; Min Operating Temperature: -25°C; Max Operating Temperature: 85°C; Package Quantity: 500; Packaging: Tray; Termination: PC Pin; Max Current Rating: 10A; Radiation Hardening: No; ComponentLink1URL: https://omronfs.omron.com/en_US/ecb/products/pdf/en-g5le.pdf?src-supplier=Digi-Key; ComponentLink1Description: https://omronfs.omron.com/en_US/ecb/products/pdf/en-g5le.pdf?src-supplier=Digi-Key
R1 R2 = Res3: Resistor; Manufacturer 1: Panasonic; Manufacturer Part Number 1: ERJ-3GEYJ103V; Description 1: Res Thick Film 0603 10K Ohm 5% 1/10W ±200ppm/°C Molded SMD Punched Carrier T/R; Resistance: 10kR; Tolerance: 5%; Power Rating: 100mW; Voltage Rating: 75V; Temperature Coefficient: 200ppm/°C; Voltage Rating (DC): 50V; Published: 8-Jun-2000; LatestRevisionDate: 29-May-2009; LatestRevisionNote: IPC-7351 Footprint Added.; PackageReference: J1-0603; Publisher: Altium Limited; PackageDescription: Chip Resistor; Supplier 1: Digi-Key; Supplier Part Number 1: P10KGDKR-ND; Stock: 22255773; Pricing 1: 1=0.1, 10=0.038, 100=0.0156, 1000=0.007, 2500=0.00607 (USD); Mount: Surface Mount; Case/Package: 0603; Weight: 7.1E-05oz; Case Code (Imperial): 0603; Case Code (Metric): 1608; Contact Plating: Tin; Min Operating Temperature: -55°C; Max Operating Temperature: 155°C; Packaging: Tape and Reel; Package Quantity: 1; Composition: Thick Film; Termination: SMD/SMT; Number of Terminations: 2; Military Standard: Not; Max Power Dissipation: 100mW; Working Voltage: 75V; Features: Automotive AEC-Q200; Length: 1.6mm; Height: 0.45mm; Width: 0.8mm; Depth: 0.8mm; REACH SVHC: No SVHC; Lead Free: Lead Free; ComponentLink1URL: http://www.farnell.com/datasheets/2059623.pdf?src-supplier=Element14; ComponentLink1Description: http://www.farnell.com/datasheets/2059623.pdf?src-supplier=Element14; ComponentLink2URL: http://industrial.panasonic.com/www-cgi/jvcr13pz.cgi?E+PZ+3+AOA0002+ERJ1GNJ120C+7+WW?src-supplier=Mouser; ComponentLink2Description: http://industrial.panasonic.com/www-cgi/jvcr13pz.cgi?E+PZ+3+AOA0002+ERJ1GNJ120C+7+WW?src-supplier=Mouser; ComponentLink3URL: http://industrial.panasonic.com/www-data/pdf/AOA0000/AOA0000CE1.pdf?src-supplier=Avnet+Europe; ComponentLink3Description: http://industrial.panasonic.com/www-data/pdf/AOA0000/AOA0000CE1.pdf?src-supplier=Avnet+Europe; ComponentLink4URL: http://www.jameco.com/Jameco/Products/ProdDS/2007265.pdf?src-supplier=Jameco; ComponentLink4Description: http://www.jameco.com/Jameco/Products/ProdDS/2007265.pdf?src-supplier=Jameco; ComponentLink5URL: http://industrial.panasonic.com/www-data/pdf/AOA0000/AOA0000CE1.pdf?src-supplier=Avnet; ComponentLink5Description: http://industrial.panasonic.com/www-data/pdf/AOA0000/AOA0000CE1.pdf?src-supplier=Avnet; ComponentLink6URL: https://industrial.panasonic.com/cdbs/www-data/pdf/RDA0000/AOA0000C301.pdf?src-supplier=Future+Electronics; ComponentLink6Description: https://industrial.panasonic.com/cdbs/www-data/pdf/RDA0000/AOA0000C301.pdf?src-supplier=Future+Electronics
R3 = Res3: as R4 on sheet Control; Published: 8-Jun-2000; LatestRevisionDate: 29-May-2009; LatestRevisionNote: IPC-7351 Footprint Added.; PackageReference: J1-0603; Publisher: Altium Limited; PackageDescription: Chip Resistor; Supplier 1: Digi-Key; Supplier Part Number 1: A130089DKR-ND; Stock: 87954; Pricing 1: 1=0.1, 10=0.021, 100=0.0086, 1000=0.00387, 2500=0.00336 (USD); Case/Package: 0603; Case Code (Imperial): 0603; Case Code (Metric): 1608; Min Operating Temperature: -55°C; Max Operating Temperature: 155°C; Composition: Thick Film; Features: Moisture Resistant,Automotive AEC-Q200; Packaging: Tape and Reel; Number of Terminations: 2; ComponentLink1URL: https://4donline.ihs.com/images/VipMasterIC/IC/TYEL/TYEL-S-A0004929575/TYEL-S-A0004929575-1.pdf?hkey=52A5661711E402568146F3353EA87419&src-supplier=Farnell; ComponentLink1Description: https://4donline.ihs.com/images/VipMasterIC/IC/TYEL/TYEL-S-A0004929575/TYEL-S-A0004929575-1.pdf?hkey=52A5661711E402568146F3353EA87419&src-supplier=Farnell; ComponentLink2URL: https://4donline.ihs.com/images/VipMasterIC/IC/TYEL/TYEL-S-A0004929575/TYEL-S-A0004929575-1.pdf?hkey=52A5661711E402568146F3353EA87419&src-supplier=Newark; ComponentLink2Description: https://4donline.ihs.com/images/VipMasterIC/IC/TYEL/TYEL-S-A0004929575/TYEL-S-A0004929575-1.pdf?hkey=52A5661711E402568146F3353EA87419&src-supplier=Newark; ComponentLink3URL: https://www.te.com/commerce/DocumentDelivery/DDEController?Action=srchrtrv&amp;DocNm=1773204-3&amp;DocType=DS&amp;DocLang=English&src-supplier=Digi-Key; ComponentLink3Description: https://www.te.com/commerce/DocumentDelivery/DDEController?Action=srchrtrv&amp;DocNm=1773204-3&amp;DocType=DS&amp;DocLang=English&src-supplier=Digi-Key; ComponentLink4URL: https://www.te.com/commerce/DocumentDelivery/DDEController?Action=srchrtrv&DocNm=1773204-3&DocType=DS&DocLang=English&src-supplier=Digi-Key; ComponentLink4Description: https://www.te.com/commerce/DocumentDelivery/DDEController?Action=srchrtrv&DocNm=1773204-3&DocType=DS&DocLang=English&src-supplier=Digi-Key
X1 = HLK-PM01: 220Vac to 5Vdc converter (3W); Manufacturer 1: Hi-Link; Manufacturer Part Number 1: PM01; ComponentLink1Description: Datasheet; ComponentLink1URL: https://datasheet.lcsc.com/szlcsc/1909111105_HI-LINK-HLK-PM24_C399250.pdf

## Nets that join several sheets
3V3: Control (5 pins), Interface (J1.2 J4.2)
5V: Control (U4.1), Interface (D1.1 J5.2 K1.4 K2.4)
GND: Control (11 pins), Interface (6 pins)
K1_IN: Control (U2.3 U2.4), Interface (K1.1)
NetJ2_1: Control (U2.1 U2.2), Interface (J2.1)
NetJ4_1: Control (U4.4), Interface (J4.1 R2.2)
NetK1_5: Control (U3.3), Interface (K1.5)
NetK2_5: Control (U3.6), Interface (K2.5)
SWIN: Control (U1.5 U4.11), Interface (J1.1 R1.2)